# EAGLE schematic Occupancy PCB (EAGLE 7.5.0)
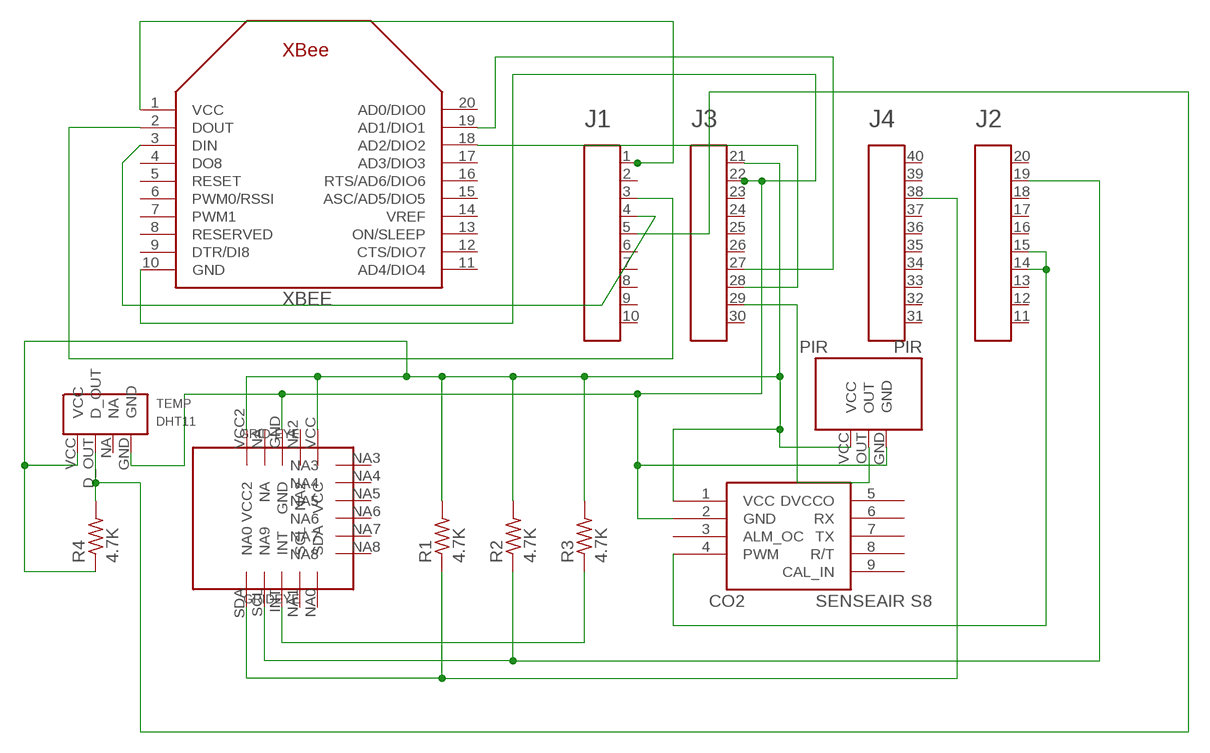
[diagram p0: schematic, sheet 1]

## Parts
CO2  SENSEAIR-S8-DIP  [SENSEAIR-S8-DIP]
GRIDEYE  GRID-EYE-DIP  [GRID-EYE-DIP]
LAUNCHPAD  HEADER4X10-BOOSTERPACK  [4X10-BOOSTERPACK]
PIR  PIR-DIP  [PIR-DIP]
R1  4.7K  R-US_R0805  [R0805]
R2  4.7K  R-US_R0805  [R0805]
R3  4.7K  R-US_R0805  [R0805]
R4  4.7K  R-US_R0805  [R0805]
TEMP  DHT11-DIP  [DHT11-DIP]
XBEE  XBEE  [XBEE]

## Nets
GND: CO2.2(GND) GRIDEYE.GND LAUNCHPAD.22 PIR.GND TEMP.GND XBEE.10(GND)
N$2: GRIDEYE.SDA(NA0) LAUNCHPAD.38 R1.1
N$3: CO2.4(PWM) LAUNCHPAD.14 LAUNCHPAD.15
N$4: LAUNCHPAD.3 XBEE.2(DOUT)
N$5: LAUNCHPAD.4 XBEE.3(DIN)
N$6: GRIDEYE.SCL(NA9) LAUNCHPAD.19 R2.1
N$7: GRIDEYE.INT R3.1
N$8: LAUNCHPAD.5 R4.2 TEMP.D_OUT
N$10: LAUNCHPAD.27 XBEE.19(AD1/DIO1)
N$11: LAUNCHPAD.28 XBEE.18(AD2/DIO2)
N$12: LAUNCHPAD.29 PIR.OUT
VCC [VCC]: CO2.1(VCC) GRIDEYE.VCC GRIDEYE.VCC2 LAUNCHPAD.21 PIR.VCC R1.2 R2.2 R3.2 R4.1 TEMP.VCC
VCC3: LAUNCHPAD.1 XBEE.1(VCC)
Unconnected: CO2.3(ALM_OC) CO2.5(DVCCO) CO2.6(RX) CO2.7(TX) CO2.8(R/T) CO2.9(CAL_IN) GRIDEYE.NA GRIDEYE.NA0(SDA) GRIDEYE.NA1(SCL) GRIDEYE.NA2 GRIDEYE.NA3 GRIDEYE.NA4 GRIDEYE.NA5 GRIDEYE.NA6 GRIDEYE.NA7 GRIDEYE.NA8 LAUNCHPAD.2 LAUNCHPAD.6 LAUNCHPAD.7 LAUNCHPAD.8 LAUNCHPAD.9 LAUNCHPAD.10 LAUNCHPAD.11 LAUNCHPAD.12 LAUNCHPAD.13 LAUNCHPAD.16 LAUNCHPAD.17 LAUNCHPAD.18 LAUNCHPAD.20 LAUNCHPAD.23 LAUNCHPAD.24 LAUNCHPAD.25 LAUNCHPAD.26 LAUNCHPAD.30 LAUNCHPAD.31 LAUNCHPAD.32 LAUNCHPAD.33 LAUNCHPAD.34 LAUNCHPAD.35 LAUNCHPAD.36 LAUNCHPAD.37 LAUNCHPAD.39 LAUNCHPAD.40 TEMP.NA XBEE.4(DO8) XBEE.5(RESET) XBEE.6(PWM0/RSSI) XBEE.7(PWM1) XBEE.8(RESERVED) XBEE.9(DTR/DI8) XBEE.11(AD4/DIO4) XBEE.12(CTS/DIO7) XBEE.13(ON/SLEEP) XBEE.14(VREF) XBEE.15(ASC/AD5/DIO5) XBEE.16(RTS/AD6/DIO6) XBEE.17(AD3/DIO3) XBEE.20(AD0/DIO0)

## Library data of the parts
CO2 = LUJAN:SENSEAIR-S8-DIP
GRIDEYE = LUJAN:GRID-EYE-DIP
LAUNCHPAD = EAGLE_BoosterPack_Library:HEADER4X10-BOOSTERPACK
PIR = LUJAN:PIR-DIP
R1-R4 = adafruit:R-US_: RESISTOR, American symbol
TEMP = LUJAN:DHT11-DIP
XBEE = adafruit:XBEE

## Net classes
0 default: width 0.305 mm, drill 0.508 mm, clearance 0.559 mm
1 VCC: width 0.559 mm, drill 0.508 mm, clearance 0.457 mm
2 GND: width 0.508 mm, drill 0.508 mm, clearance 0.457 mm